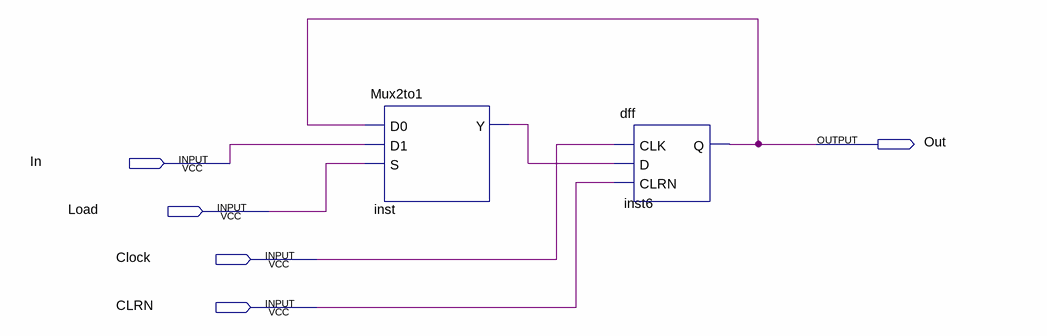
[diagram p0: schematic sheet]
// Quartus schematic Register.bdf as structural Verilog: 2 symbols, 5 pins
module Register (
  input  In,
  input  Load,
  input  Clock,
  input  CLRN,
  output Out
);

  wire inst_y;

  Mux2to1 inst (.D0(Out), .D1(In), .S(Load), .Y(inst_y));
  dff inst6 (.CLK(Clock), .D(inst_y), .CLRN(CLRN), .Q(Out));
endmodule
